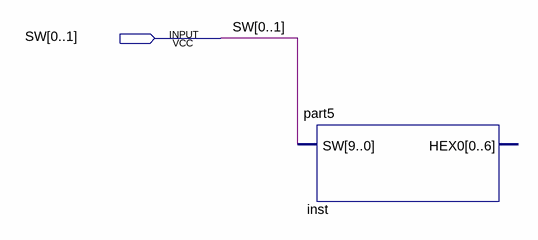
[diagram p0: schematic sheet]
// Quartus schematic Block1.bdf as structural Verilog: 1 symbols, 1 pins
module Block1 (
  input  [0:1] SW
);

  part5 inst (.SW(SW));  // open: HEX0
endmodule
